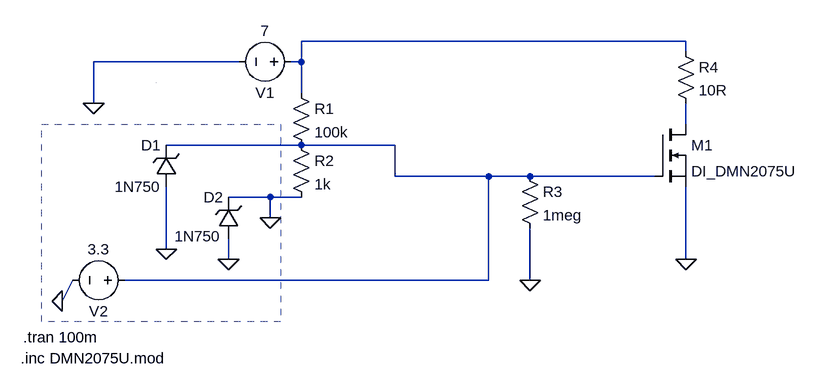
[diagram p0: schematic sim.asc]
sim.asc, the LTspice schematic file:
Version 4
SHEET 1 1008 680
WIRE 816 -64 224 -64
WIRE 816 -48 816 -64
WIRE 128 -32 -96 -32
WIRE 224 -32 224 -64
WIRE 224 -32 208 -32
WIRE 224 16 224 -32
WIRE -96 32 -96 -32
WIRE 816 64 816 32
WIRE 224 96 16 96
WIRE 368 96 224 96
WIRE 368 144 368 96
WIRE 512 144 368 144
WIRE 576 144 512 144
WIRE 768 144 576 144
WIRE 176 176 112 176
WIRE 224 176 176 176
WIRE 176 208 176 176
WIRE 16 256 16 160
WIRE 112 272 112 240
WIRE 816 272 816 160
WIRE 512 304 512 144
WIRE 512 304 -48 304
WIRE 576 304 576 224
WIRE -144 336 -128 304
WIRE 0 0 0 0
FLAG 16 256 0
FLAG -96 32 0
FLAG 112 272 0
FLAG 176 208 0
FLAG 816 272 0
FLAG 576 304 0
FLAG -144 336 0
SYMBOL zener 32 160 R180
WINDOW 0 24 64 Left 2
WINDOW 3 24 0 Left 2
SYMATTR InstName D1
SYMATTR Value 1N750
SYMATTR Description Diode
SYMATTR Type diode
SYMBOL res 208 0 R0
SYMATTR InstName R1
SYMATTR Value 100k
SYMBOL voltage 224 -32 R90
WINDOW 0 32 56 VTop 2
WINDOW 3 -32 56 VBottom 2
WINDOW 123 0 0 Left 2
WINDOW 39 0 0 Left 2
SYMATTR InstName V1
SYMATTR Value 7
SYMBOL res 208 80 R0
SYMATTR InstName R2
SYMATTR Value 1k
SYMBOL zener 128 240 R180
WINDOW 0 24 64 Left 2
WINDOW 3 28 4 Left 2
SYMATTR InstName D2
SYMATTR Value 1N750
SYMATTR Description Diode
SYMATTR Type diode
SYMBOL nmos 768 64 R0
SYMATTR InstName M1
SYMATTR Value DI_DMN2075U
SYMATTR Prefix X
SYMBOL res 560 128 R0
SYMATTR InstName R3
SYMATTR Value 1meg
SYMBOL res 800 -64 R0
SYMATTR InstName R4
SYMATTR Value 10R
SYMBOL voltage -32 304 R90
WINDOW 0 32 56 VTop 2
WINDOW 3 -32 56 VBottom 2
WINDOW 123 0 0 Left 2
WINDOW 39 0 0 Left 2
SYMATTR InstName V2
SYMATTR Value 3.3
TEXT -204 392 Left 2 !.tran 100m
TEXT -208 424 Left 2 !.inc DMN2075U.mod
RECTANGLE Normal 192 368 -176 64 2

The netlist it stands for:
* sim.asc
D1 0 N003 1N750
R1 N001 N003 100k
V1 N001 0 7
R2 N003 0 1k
D2 0 0 1N750
XM1 N002 N003 0 DI_DMN2075U  ; pins D G S
R3 N003 0 1meg
R4 N001 N002 10R
V2 N003 0 3.3
.model D D
.lib standard.dio
.tran 100m
.inc DMN2075U.mod
.backanno
.end